# Altium schematic sheet microcontroleur.SchDoc: Thymio2
size A4; Organization: Original design LSRO-STI-EPFL; Address1: Association Mobsya; Address2: Michael Bonani; Address3: Ch. Closel 3; Address4: CH-1020 Renens; DocumentNumber: 2; Revision: 2.3; SheetNumber: 2; SheetTotal: 9; Engineer: Michael Bonani; Title2: PCB principal; ProjectName: Project Name
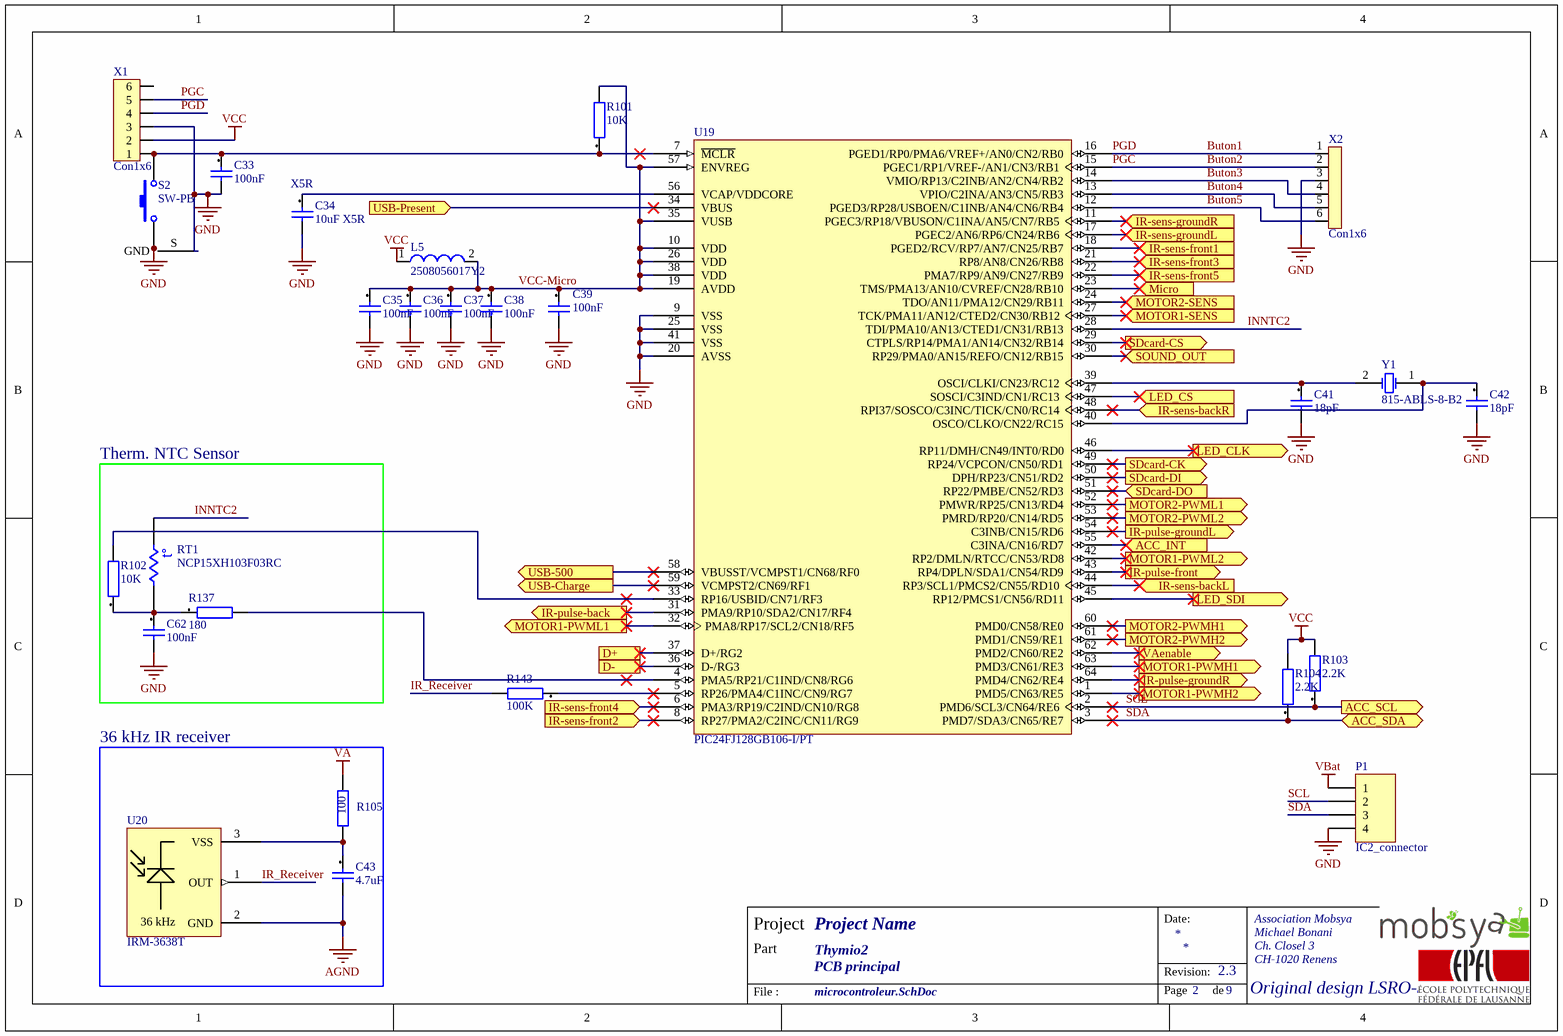
[diagram p0: microcontroleur.SchDoc]

## Parts
C33  100nF  [CAPC1005X05N]
C34  10uF X5R  Dielectric: X5R  [CAPC1005X05N]
C35  100nF  [CAPC1005X05N]
C36  100nF  [CAPC1005X05N]
C37  100nF  [CAPC1005X05N]
C38  100nF  [CAPC1005X05N]
C39  100nF  [CAPC1005X05N]
C41  18pF  [CAPC1005X05N]
C42  18pF  [CAPC1005X05N]
C43  4.7uF  [CAPC1005X05N]
C62  100nF  [CAPC1005X05N]
L5  2508056017Y2  [INDC2012X11L]
P1  IC2_connector  [HDR1X4]
R101  10K  [RESC1005X04N]
R102  10K  [RESC1005X04N]
R103  2.2K  [RESC1005X04N]
R104  2.2K  [RESC1005X04N]
R105  100  [RESC1005X04N]
R137  180  [RESC1005X04N]
R143  100K  [RESC1005X04N]
RT1  NCP15XH103F03RC  [RESC1005X04L]
S2  SW-PB  [FSMRA2JH]
U19  PIC24FJ128GB106-I/PT  [TQFP-PT64_N]
U20  IRM-3638T  [IR-receiver]
X1  Con1x6  [TYCO_7-215079-6]
X2  Con1x6  [MHDR1X6]
Y1  815-ABLS-8-B2  [HC49/4H_SMX]

## Blocks framed on the sheet
Therm. NTC Sensor: C62 R102 R137 RT1
36 kHz IR receiver: C43 R105 U20

## Ports
ACC_INT (in), ACC_SCL (out), ACC_SDA (bidir), D+, D-, IR-pulse-back (out), IR-pulse-front (out), IR-pulse-groundL (out), IR-pulse-groundR (out), IR-sens-backL (in), IR-sens-backR (in), IR-sens-front1 (in), IR-sens-front2 (in), IR-sens-front3 (in), IR-sens-front4 (in), IR-sens-front5 (in), IR-sens-groundL (in), IR-sens-groundR (in), LED_CLK (out), LED_CS (in), LED_SDI (out), Micro (in), MOTOR1-PWMH1 (out), MOTOR1-PWMH2 (out), MOTOR1-PWML1 (out), MOTOR1-PWML2 (out), MOTOR1-SENS (in), MOTOR2-PWMH1 (out), MOTOR2-PWMH2 (out), MOTOR2-PWML1 (out), MOTOR2-PWML2 (out), MOTOR2-SENS (in), SDcard-CK (out), SDcard-CS (out), SDcard-DI (out), SDcard-DO (in), SOUND_OUT (in), USB-500 (out), USB-Charge (out), USB-Present (in), VAenable (out)

## Nets
AGND: C43.2 U20.2(GND)
GND: C33.2 C34.2 C35.2 C36.2 C37.2 C38.2 C39.2 C41.2 C42.2 C62.2 P1.4 S2.1 S2.S(GND) U19.9(VSS) U19.20(AVSS) U19.25(VSS) U19.41(VSS) X1.3 X2.3
VA: R105.2
VBat: P1.1
VCC: L5.1 R103.2 R104.2 X1.2
ACC_INT: U19.55(C3INA/CN16/RD7) ; port ACC_INT
Buton1: U19.16(PGED1/RP0/PMA6/VREF+/AN0/CN2/RB0) X1.4 X2.1  [also labelled PGD]
Buton2: U19.15(PGEC1/RP1/VREF-/AN1/CN3/RB1) X1.5 X2.2  [also labelled PGC]
Buton3: U19.14(VMIO/RP13/C2INB/AN2/CN4/RB2) X2.4
Buton4: U19.13(VPIO/C2INA/AN3/CN5/RB3) X2.5
Buton5: U19.12(PGED3/RP28/USBOEN/C1INB/AN4/CN6/RB4) X2.6
D+: U19.37(D+/RG2) ; port D+
D-: U19.36(D-/RG3) ; port D-
INNTC2: RT1.1 U19.28(TDI/PMA10/AN13/CTED1/CN31/RB13)
IR-pulse-back: U19.31(PMA9/RP10/SDA2/CN17/RF4) ; port IR-pulse-back
IR-pulse-front: U19.43(RP4/DPLN/SDA1/CN54/RD9) ; port IR-pulse-front
IR-pulse-groundL: U19.54(C3INB/CN15/RD6) ; port IR-pulse-groundL
IR-pulse-groundR: U19.64(PMD4/CN62/RE4) ; port IR-pulse-groundR
IR-sens-backL: U19.44(RP3/SCL1/PMCS2/CN55/RD10) ; port IR-sens-backL
IR-sens-backR: U19.48(RPI37/SOSCO/C3INC/TICK/CN0/RC14) ; port IR-sens-backR
IR-sens-front1: U19.18(PGED2/RCV/RP7/AN7/CN25/RB7) ; port IR-sens-front1
IR-sens-front2: U19.8(RP27/PMA2/C2INC/CN11/RG9) ; port IR-sens-front2
IR-sens-front3: U19.21(RP8/AN8/CN26/RB8) ; port IR-sens-front3
IR-sens-front4: U19.6(PMA3/RP19/C2IND/CN10/RG8) ; port IR-sens-front4
IR-sens-front5: U19.22(PMA7/RP9/AN9/CN27/RB9) ; port IR-sens-front5
IR-sens-groundL: U19.17(PGEC2/AN6/RP6/CN24/RB6) ; port IR-sens-groundL
IR-sens-groundR: U19.11(PGEC3/RP18/VBUSON/C1INA/AN5/CN7/RB5) ; port IR-sens-groundR
IR_Receiver: R143.2 U20.1(OUT)
LED_CLK: U19.46(RP11/DMH/CN49/INT0/RD0) ; port LED_CLK
LED_CS: U19.47(SOSCI/C3IND/CN1/RC13) ; port LED_CS
LED_SDI: U19.45(RP12/PMCS1/CN56/RD11) ; port LED_SDI
Micro: U19.23(TMS/PMA13/AN10/CVREF/CN28/RB10) ; port Micro
MOTOR1-PWMH1: U19.63(PMD3/CN61/RE3) ; port MOTOR1-PWMH1
MOTOR1-PWMH2: U19.1(PMD5/CN63/RE5) ; port MOTOR1-PWMH2
MOTOR1-PWML1: U19.32(PMA8/RP17/SCL2/CN18/RF5) ; port MOTOR1-PWML1
MOTOR1-PWML2: U19.42(RP2/DMLN/RTCC/CN53/RD8) ; port MOTOR1-PWML2
MOTOR1-SENS: U19.27(TCK/PMA11/AN12/CTED2/CN30/RB12) ; port MOTOR1-SENS
MOTOR2-PWMH1: U19.60(PMD0/CN58/RE0) ; port MOTOR2-PWMH1
MOTOR2-PWMH2: U19.61(PMD1/CN59/RE1) ; port MOTOR2-PWMH2
MOTOR2-PWML1: U19.52(PMWR/RP25/CN13/RD4) ; port MOTOR2-PWML1
MOTOR2-PWML2: U19.53(PMRD/RP20/CN14/RD5) ; port MOTOR2-PWML2
MOTOR2-SENS: U19.24(TDO/AN11/PMA12/CN29/RB11) ; port MOTOR2-SENS
SCL: P1.2 R103.1 U19.2(PMD6/SCL3/CN64/RE6) ; port ACC_SCL
SDA: P1.3 R104.1 U19.3(PMD7/SDA3/CN65/RE7) ; port ACC_SDA
SDcard-CK: U19.49(RP24/VCPCON/CN50/RD1) ; port SDcard-CK
SDcard-CS: U19.29(CTPLS/RP14/PMA1/AN14/CN32/RB14) ; port SDcard-CS
SDcard-DI: U19.50(DPH/RP23/CN51/RD2) ; port SDcard-DI
SDcard-DO: U19.51(RP22/PMBE/CN52/RD3) ; port SDcard-DO
SOUND_OUT: U19.30(RP29/PMA0/AN15/REFO/CN12/RB15) ; port SOUND_OUT
USB-500: U19.58(VBUSST/VCMPST1/CN68/RF0) ; port USB-500
USB-Charge: U19.59(VCMPST2/CN69/RF1) ; port USB-Charge
USB-Present: U19.34(VBUS) ; port USB-Present
VAenable: U19.62(PMD2/CN60/RE2) ; port VAenable
VCC-Micro: C35.1 C36.1 C37.1 C38.1 C39.1 L5.2 R101.2 U19.10(VDD) U19.19(AVDD) U19.26(VDD) U19.35(VUSB) U19.38(VDD) U19.57(ENVREG)
NetC33_1: C33.1 R101.1 S2.2 U19.7(~{MCLR}) X1.1
NetC34_1: C34.1 U19.56(VCAP/VDDCORE)
NetC41_1: C41.1 U19.39(OSCI/CLKI/CN23/RC12) Y1.2(OSC2)
NetC42_1: C42.1 U19.40(OSCO/CLKO/CN22/RC15) Y1.1(OSC1)
NetC43_1: C43.1 R105.1 U20.3(VSS)
NetC62_1: C62.1 R102.1 R137.1 RT1.2
NetR102_2: R102.2 U19.33(RP16/USBID/CN71/RF3)
NetR137_2: R137.2 U19.4(PMA5/RP21/C1IND/CN8/RG6)
NetR143_1: R143.1 U19.5(RP26/PMA4/C1INC/CN9/RG7)

Not connected (* = marked no-connect by the designer): X1 6

## Notes on the sheet
- Date:
- Project
- Part
- Revision:
- File :
- Page
- de
- (in symbol Res Thermal) t°
- (in symbol TSOP32236) 36 kHz

## Library data of the parts
C33 C35-C39 C62 = 100nF[[/\]]0603[[/\]]1: Capacitor; Manufacturer: Kemet; Manufacturer Nr: C0603C104K5RAC; Preference: 1; Tolerance +: +10; Tolerance -: -10; Dielectric: X7R; Voltage: 50; MaxTemperature: +125; MinTemperature: -55; Quant_1: 10; Quant_2: 100; Quant_3: 1000; Quant_4: 4000; Currentie: CHF; LayerSch: Top; Size: 0603; Footprint Acort: 0603_G; Supplier: Farnell; Supplier Nr: 1288255; ComponentLink2Description: Farnell link; ComponentLink2URL: http://ch.farnell.com/jsp/displayProduct.jsp?sku=1288255; Price_1: 0.046; Price_2: 0.04; Price_3: 0.037; Price_4: 0.036; ROHS: True; DateLastUpdate: 2007-12-03 / 14:22:31
C34 = 10uF[[/\]]0603[[/\]]1: Capacitor; Manufacturer: Taiyo Yuden; Manufacturer Nr: JMK107BJ106MA-T; Preference: 1; Tolerance +: +15; Tolerance -: -15; Voltage: 6.3; MaxTemperature: +85; MinTemperature: -55; Quant_2: 100; Quant_3: 500; Currentie: CHF; LayerSch: Top; Size: 0603; Footprint Acort: 0603_G; Supplier: Farnell; Supplier Nr: 1463375; ComponentLink2Description: Farnell link; ComponentLink2URL: http://ch.farnell.com/jsp/displayProduct.jsp?sku=1463375; Quant_1: 1; Price_1: 0.768; Price_2: 0.674; Price_3: 0.372; ROHS: True; DateLastUpdate: 2007-12-03 / 14:22:36
C41 C42 = 10pF[[/\]]0603[[/\]]3: Manufacturer: Murata; Manufacturer Nr: GRM1885C1H100JA01D; Preference: 3; Tolerance +: +5; Tolerance -: -5; Dielectric: COG; Voltage: 50; MaxTemperature: +125; MinTemperature: -55; Quant_1: 10; Quant_2: 100; Quant_3: 500; Quant_4: 1000; Quant_5: 4000; Quant_6: 8000; Currentie: CHF; Size: 0603; Footprint Acort: 0603_G; Supplier: Farnell; Supplier Nr: 8819815; ComponentLink2Description: Farnell link; ComponentLink2URL: http://ch.farnell.com/jsp/displayProduct.jsp?sku=8819815; Price_1: 0.071; Price_2: 0.061; Price_3: 0.051; Price_4: 0.041; Price_5: 0.031; Price_6: 0.02; ROHS: True; DateLastUpdate: 2007-12-03 / 14:22:35
C43 = 4.7uF[[/\]]0603[[/\]]1: Capacitor; Manufacturer: Kemet; Manufacturer Nr: C0603C475K9PAC; Preference: 1; Tolerance +: +10; Tolerance -: -10; Dielectric: X5R; Voltage: 6.3; MaxTemperature: +85; MinTemperature: -55; Quant_1: 10; Quant_2: 100; Quant_3: 1000; Quant_4: 4000; Currentie: CHF; Size: 0603; Footprint Acort: 0603_G; Supplier: Farnell; Supplier Nr: 9227784; ComponentLink2Description: Farnell link; ComponentLink2URL: http://ch.farnell.com/jsp/displayProduct.jsp?sku=9227784; Price_1: 0.33; Price_2: 0.298; Price_3: 0.278; Price_4: 0.246; ROHS: True; DateLastUpdate: 2007-12-03 / 14:22:57
L5 = 74279204: SMD EMI Suppression Ferrite Bead WE-CBF, Z = 600 Ohm; Impedance: 600 Ohm; PackageReference: SMD-0805; PackageDescription: Chip Inductor, 2-Leads, Body 2.0 x 1.2 mm; PartNumber: 2508056017Y2; ComponentLink1Description: Fair-Rite; ComponentLink2Description: https://www.mouser.ch/datasheet/2/150/2508056017Y2-472219.pdf
P1 = Header 4: Header, 4-Pin; LatestRevisionDate: 17-Jul-2002; LatestRevisionNote: Re-released for DXP Platform.; Publisher: Altium Limited
R101 R102 = 10K[[/\]]0603[[/\]]2: Resistor; Manufacturer: Multicomp; Manufacturer Nr: MC 0.063W 0603 1% 10K; Tolerance: +/-1; Preference: 2; Power: 0.063; Voltage: 50; Current: 1; ppm/K: +/-100; Quant_2: 250; Quant_3: 1000; Quant_4: 5000; Quant_5: 15000; Currentie: CHF; LayerSch: Top; Size: 0603; Footprint Acort: 0603; ComponentLink1Description: OnLine datasheet; Supplier: Farnell; Supplier Nr: 9330399; ComponentLink2Description: Farnell link; ComponentLink2URL: http://ch.farnell.com/jsp/displayProduct.jsp?sku=9330399; ROHS: True; Quant_1: 50; Price_1: 0.062; Price_2: 0.049; Price_3: 0.038; Price_4: 0.027; Price_5: 0.021; DateLastUpdate: 2007-11-29 / 09:14:40
R103 R104 = 4.7K[[/\]]0603[[/\]]1: Resistor; Manufacturer: Vishay; Manufacturer Nr: D11CRCW06030B4701F; Tolerance: +/-1; Preference: 1; Power: 0.1; Voltage: 75; Current: 1.5; ppm/K: +/-100; Quant_1: 10; Quant_2: 100; Quant_3: 500; Currentie: CHF; LayerSch: Top; Size: 0603; Footprint Acort: 0603; Supplier: Distrelec; Supplier Nr: 715604; ComponentLink2Description: Distrelec link; ComponentLink2URL: http://www.distrelec.com/ishopWebFront/search/luceneSearch.do?dispatch=find&showImage=on&artnrPhrase=715604; ROHS: True; Price_1: 0.0538; Price_2: 0.0323; Price_3: 0.0204; DateLastUpdate: 2007-12-03 / 16:30:20
R105 = RES_ACORT: Resistance; ClassName: IR
R137 = 180R[[/\]]0603[[/\]]1: Resistor; Manufacturer: Vishay; Manufacturer Nr: D11CRCW06030B4703F; Tolerance: +/-1; Preference: 1; Power: 0.1; Voltage: 75; Current: 1.5; ppm/K: +/-100; Quant_1: 10; Quant_2: 100; Quant_3: 500; Currentie: CHF; LayerSch: Top; Size: 0603; Footprint Acort: 0603; Supplier: Distrelec; Supplier Nr: 715570; ComponentLink2Description: Distrelec link; ComponentLink2URL: http://www.distrelec.com/ishopWebFront/search/luceneSearch.do?dispatch=find&showImage=on&artnrPhrase=715570; ROHS: True; Price_1: 0.0538; Price_2: 0.0323; Price_3: 0.0204; DateLastUpdate: 2007-12-03 / 16:30:19
R143 = 100K[[/\]]0603[[/\]]1: Resistor; Manufacturer: Vishay; Manufacturer Nr: D11CRCW06030B1003F; Tolerance: +/-1; Preference: 1; Power: 0.1; Voltage: 75; Current: 1.5; ppm/K: +/-100; Quant_1: 10; Quant_2: 100; Quant_3: 500; Currentie: CHF; Size: 0603; Footprint Acort: 0603; ComponentLink1Description: OnLine datasheet; Supplier: Distrelec; Supplier Nr: 715636; ComponentLink2Description: Distrelec link; ComponentLink2URL: http://www.distrelec.com/ishopWebFront/search/luceneSearch.do?dispatch=find&showImage=on&artnrPhrase=715636; ROHS: True; Price_1: 0.0538; Price_2: 0.0323; Price_3: 0.0204; DateLastUpdate: 2007-12-03 / 16:29:58
RT1 = Res Thermal: Thermistors - NTC 10K OHM 1% 0402; LayerSch: Top; Published: 24-Mar-1999; LatestRevisionDate: 29-May-2009; LatestRevisionNote: IPC-7351 Footprint Added.; PackageVersion: Mar-2003; PackageReference: 6-0805; Publisher: Altium Limited; PackageDescription: Chip Resistor 0805 Case Size; Code_IPC: RESC2012
S2 = SW-PB: Switch; Published: 24-Mar-1999; LatestRevisionDate: 17-Jul-2002; LatestRevisionNote: Re-released for DXP Platform.; PackageReference: SPST-2; Publisher: Altium Limited
U19 = PIC24FJ128GB106-I/PT: General Purpose 16-Bit Flash Microcontroller with USB On-The-Go, 128KB Flash, 16KB SRAM, 64-Pin TQFP, Industrial Temperature; FirstPublished: 29-Jan-2009; DatasheetVersion: revB, Mar-2008; PackageVersion: revBB, Aug-2009; PackageReference: TQFP-PT64; Publisher: Altium Limited; PackageDescription: 64-Lead Thin Plastic Quad Flat Pack (PT) - 10x10x1mm Body, 2.00mm [TQFP]; Supplier 1: Digi-Key; Supplier Part Number 1: PIC24FJ128GB106-I/PT-ND; Supplier 2: Farnell; Supplier Part Number 2: 1576850; Supplier 3: Newark; Supplier Part Number 3: 54M5097; Code_JEDEC: MS-026; ComponentLink1Description: Datasheet; ComponentLink1URL: http://ww1.microchip.com/downloads/en/DeviceDoc/39897b.pdf; ComponentLink2Description: Packaging Specification; ComponentLink2URL: http://www.microchip.com/stellent/groups/techpub_sg/documents/packagingspec/en012702.pdf; ComponentLink3Description: Microchip.com Home; ComponentLink3URL: http://www.microchip.com/
U20 = TSOP32236: IR Receiver Module (38 kHz) for Remote Control Systems; LayerSch: Top; Farnell: 4913103; ClassName: IR
X1 = Con1x6_1: 1 x 6 pins connector
X2 = Con1x6: 1 x 6 pins connector; LayerSch: Top
Y1 = HC49/4H_SMX: Surface Mount Quartz Crystal 8Mhz; Note: PCB layout complies with manufacturer's recommendation.; Published: 17-Jul-2002; DatasheetDocument: 18-Oct-1999; PackageDocument: 18-Oct-1999; PackageReference: HC49/4H_SMX; Publisher: Altium Limited; ComponentLink1Description: Manufacturer Link; ComponentLink1URL: http://www.cmac.com/mt/; ComponentLink2Description: Datasheet; ComponentLink2URL: http://www.cmac.com/mt/databook/crystals/smd/hc49_4h_smx.pdf